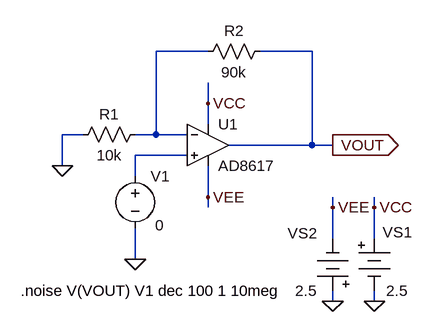
[diagram p0: schematic fig-03-02-09.asc]
fig-03-02-09.asc, the LTspice schematic file:
Version 4
SHEET 1 880 680
WIRE 208 32 128 32
WIRE 368 32 288 32
WIRE 208 112 208 80
WIRE 208 144 208 112
WIRE 16 160 -16 160
WIRE 128 160 128 32
WIRE 128 160 96 160
WIRE 176 160 128 160
WIRE 368 176 368 32
WIRE 368 176 240 176
WIRE 400 176 368 176
WIRE 176 192 96 192
WIRE -16 208 -16 160
WIRE 96 224 96 192
WIRE 208 256 208 208
WIRE 208 272 208 256
WIRE 400 272 400 256
WIRE 464 272 464 256
WIRE 400 320 400 272
WIRE 464 320 464 272
WIRE 96 352 96 304
WIRE 400 416 400 400
WIRE 464 416 464 400
FLAG 96 352 0
FLAG -16 208 0
FLAG 400 176 VOUT
IOPIN 400 176 Out
FLAG 400 416 0
FLAG 464 416 0
FLAG 400 272 VEE
FLAG 464 272 VCC
FLAG 208 112 VCC
FLAG 208 256 VEE
SYMBOL res 304 16 R90
WINDOW 0 0 56 VBottom 2
WINDOW 3 32 56 VTop 2
SYMATTR InstName R2
SYMATTR Value 90k
SYMBOL Misc\\battery 464 304 R0
WINDOW 0 13 6 Left 2
WINDOW 3 18 96 Left 2
WINDOW 123 0 0 Left 0
WINDOW 39 0 0 Left 0
SYMATTR InstName VS1
SYMATTR Value 2.5
SYMBOL Misc\\battery 400 416 R180
WINDOW 0 24 104 Left 2
WINDOW 3 24 16 Left 2
WINDOW 123 0 0 Left 0
WINDOW 39 0 0 Left 0
SYMATTR InstName VS2
SYMATTR Value 2.5
SYMBOL res 112 144 R90
WINDOW 0 0 56 VBottom 2
WINDOW 3 32 56 VTop 2
SYMATTR InstName R1
SYMATTR Value 10k
SYMBOL voltage 96 208 R0
WINDOW 3 31 91 Left 2
WINDOW 123 0 0 Left 0
WINDOW 39 0 0 Left 0
SYMATTR Value 0
SYMATTR InstName V1
SYMBOL Opamps\\AD8617 208 112 R0
SYMATTR InstName U1
TEXT -80 400 Left 2 !.noise V(VOUT) V1 dec 100 1 10meg

The netlist it stands for:
* fig-03-02-09.asc
R2 VOUT N001 90k
VS1 VCC 0 2.5
VS2 0 VEE 2.5
R1 N001 0 10k
V1 N002 0 0
XU1 N002 N001 VCC VEE VOUT AD8617  ; pins In+ In- V+ V- OUT
.noise V(VOUT) V1 dec 100 1 10meg
.backanno
.end